# Altium schematic sheet FQDMDSchematic.SchDoc (part 1 of 3)
size A4; SheetNumber: 1; SheetTotal: 1
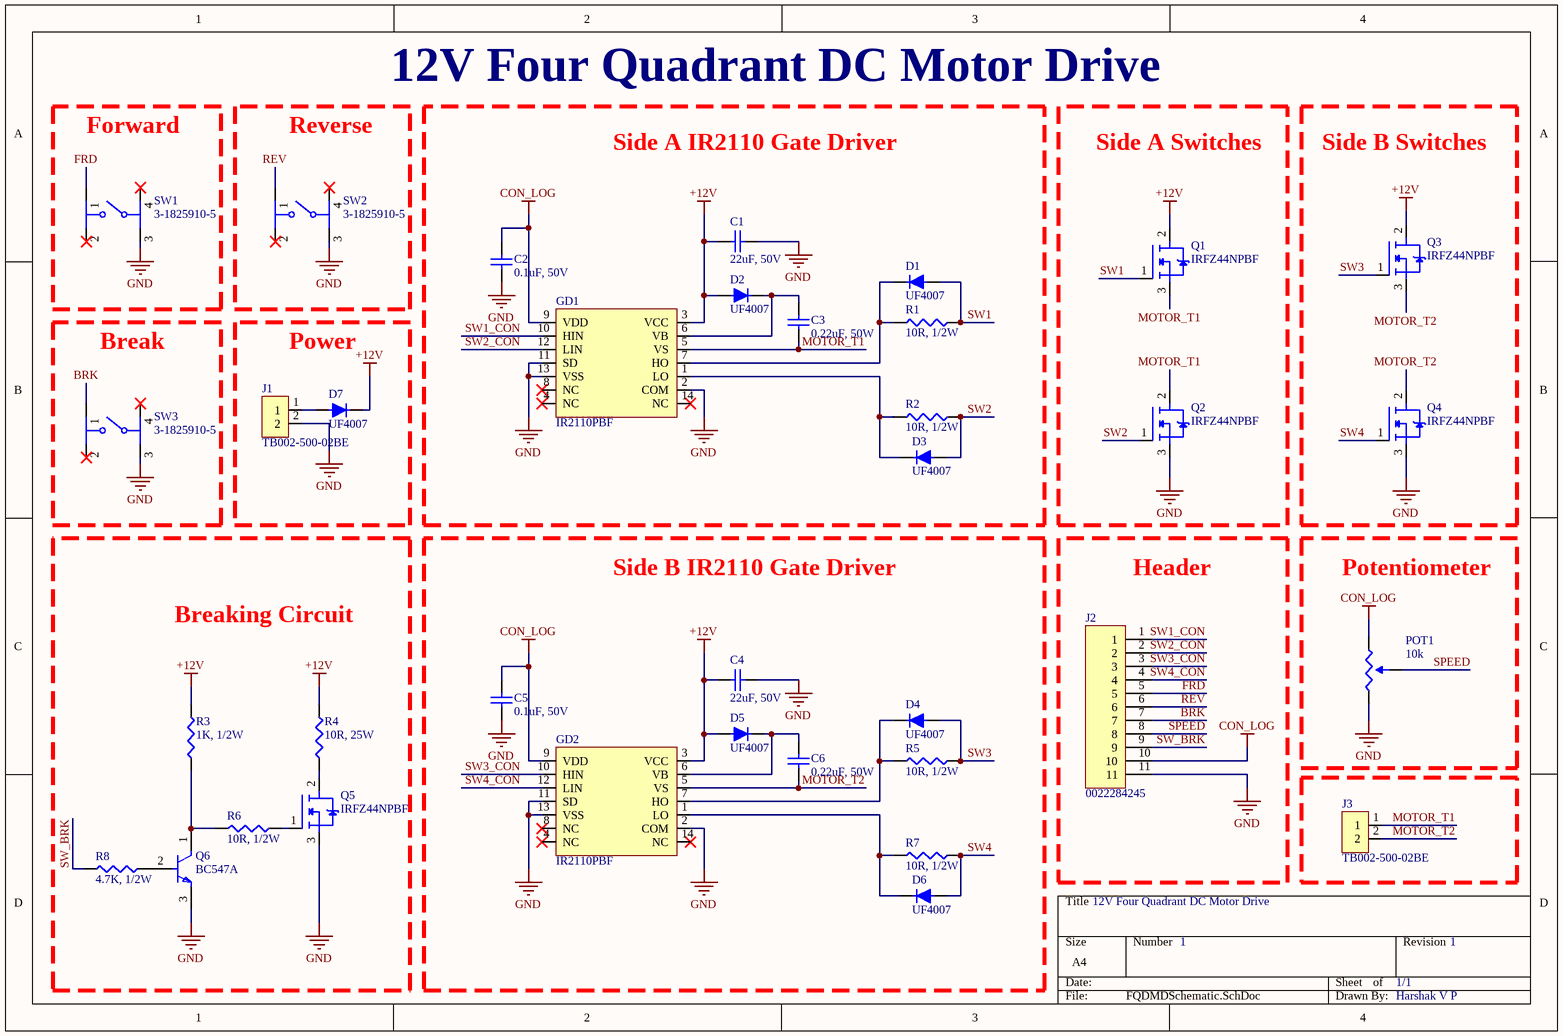
[diagram p0: FQDMDSchematic.SchDoc]

## Parts
C1  22uF, 50V  [Capacitor_Polarized_TH]
C2  0.1uF, 50V  [Capacitor_Ceramic_TH]
C3  0.22uF, 50W  [Capacitor_Ceramic_TH]
C4  22uF, 50V  [Capacitor_Polarized_TH]
C5  0.1uF, 50V  [Capacitor_Ceramic_TH]
C6  0.22uF, 50W  [Capacitor_Ceramic_TH]
D1  UF4007  [Diode_TH]
D2  UF4007  [Diode_TH]
D3  UF4007  [Diode_TH]
D4  UF4007  [Diode_TH]
D5  UF4007  [Diode_TH]
D6  UF4007  [Diode_TH]
D7  UF4007  [Diode_TH]
GD1  IR2110PBF  [IR2110PBF_DIP14]
GD2  IR2110PBF  [IR2110PBF_DIP14]
J1  TB002-500-02BE  [Terminal_Block]
J2  0022284245  [Conneting_Jumpers]
J3  TB002-500-02BE  [Terminal_Block]
POT1  10k  [Potentiometer]
Q1  IRFZ44NPBF  [IRFZ44NPBF]
Q2  IRFZ44NPBF  [IRFZ44NPBF]
Q3  IRFZ44NPBF  [IRFZ44NPBF]
Q4  IRFZ44NPBF  [IRFZ44NPBF]
Q5  IRFZ44NPBF  [IRFZ44NPBF]
Q6  BC547A  [TRANS_BC547A]
R1  10R, 1/2W  [Resistor_TH]
R2  10R, 1/2W  [Resistor_TH]
R3  1K, 1/2W  [Resistor_TH]
R4  10R, 25W  [Braking_Resistor]
R5  10R, 1/2W  [Resistor_TH]
R6  10R, 1/2W  [Resistor_TH]
R7  10R, 1/2W  [Resistor_TH]
R8  4.7K, 1/2W  [Resistor_TH]
SW1  3-1825910-5  [Pushbutton]
SW2  3-1825910-5  [Pushbutton]
SW3  3-1825910-5  [Pushbutton]

## Blocks framed on the sheet
Forward: SW1
12V Four Quadrant DC Motor Drive: SW2
Side A IR2110 Gate Driver: C1-C3 D1-D3 GD1 R1 R2
Side A Switches: Q1 Q2
Side B Switches: Q3 Q4
Break: SW3
Power: D7 J1
Breaking Circuit: Q5 Q6 R3 R4 R6 R8
Side B IR2110 Gate Driver: C4-C6 D4-D6 GD2 R5 R7
Header: J2
Potentiometer: POT1

## Nets
+12V: C1.1 C4.1 D2.1 D5.1 D7.2 GD1.3(VCC) GD2.3(VCC) Q1.2(D) Q3.2(D) R3.2 R4.2
CON_LOG: C2.2 C5.2 GD1.9(VDD) GD2.9(VDD) J2.10 POT1.1
GND: C1.2 C2.1 C4.2 C5.1 GD1.2(COM) GD1.11(SD) GD1.13(VSS) GD2.2(COM) GD2.11(SD) GD2.13(VSS) J1.2 J2.11 POT1.2 Q2.3(S) Q4.3(S) Q5.3(S) Q6.3(E) SW1.4 SW2.4 SW3.4
BRK: J2.7 SW3.1
FRD: J2.5 SW1.1
MOTOR_T1: C3.1 GD1.5(VS) J3.1 Q1.3(S) Q2.2(D)
MOTOR_T2: C6.1 GD2.5(VS) J3.2 Q3.3(S) Q4.2(D)
REV: J2.6 SW2.1
SPEED: J2.8 POT1.3
SW1: D1.1 Q1.1(G) R1.1
SW1_CON: GD1.10(HIN) J2.1
SW2: D3.1 Q2.1(G) R2.1
SW2_CON: GD1.12(LIN) J2.2
SW3: D4.1 Q3.1(G) R5.1
SW3_CON: GD2.10(HIN) J2.3
SW4: D6.1 Q4.1(G) R7.1
SW4_CON: GD2.12(LIN) J2.4
SW_BRK: J2.9 R8.1
NetC3_2: C3.2 D2.2 GD1.6(VB)
NetC6_2: C6.2 D5.2 GD2.6(VB)
NetD1_2: D1.2 GD1.7(HO) R1.2
NetD3_2: D3.2 GD1.1(LO) R2.2
NetD4_2: D4.2 GD2.7(HO) R5.2
NetD6_2: D6.2 GD2.1(LO) R7.2
NetD7_1: D7.1 J1.1
NetQ5_1: Q5.1(G) R6.2
NetQ5_2: Q5.2(D) R4.1
NetQ6_1: Q6.1(C) R3.1 R6.1
NetQ6_2: Q6.2(B) R8.2

Not connected (* = marked no-connect by the designer): GD1 4(NC)* 8(NC)* 14(NC)*; GD2 4(NC)* 8(NC)* 14(NC)*; SW1 2* 3*; SW2 2* 3*; SW3 2* 3*

## Notes on the sheet
- Reverse
- 12V Four Quadrant DC Motor Drive
- 1
- 1/1
- Harshak V P